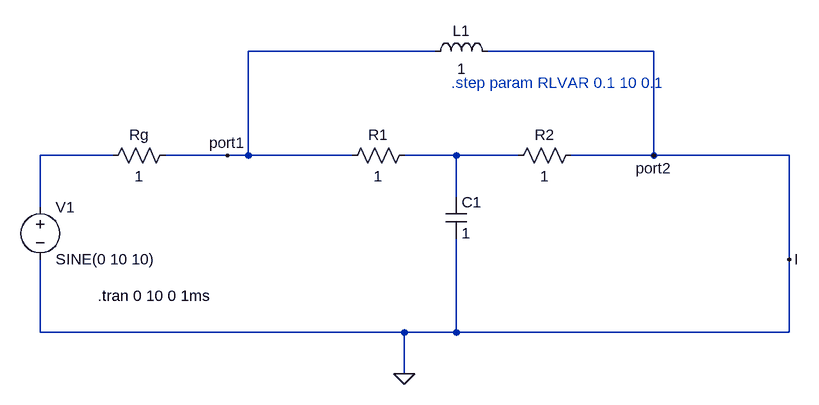
[diagram p0: schematic Draft3.asc]
Draft3.asc, the LTspice schematic file:
Version 4
SHEET 1 1396 680
WIRE 736 16 448 16
WIRE 1072 16 816 16
WIRE 240 176 128 176
WIRE 416 176 320 176
WIRE 448 176 448 16
WIRE 448 176 416 176
WIRE 608 176 448 176
WIRE 768 176 688 176
WIRE 864 176 768 176
WIRE 1072 176 1072 16
WIRE 1072 176 944 176
WIRE 1280 176 1072 176
WIRE 768 240 768 176
WIRE 128 256 128 176
WIRE 1280 336 1280 176
WIRE 128 448 128 336
WIRE 688 448 128 448
WIRE 768 448 768 304
WIRE 768 448 688 448
WIRE 1280 448 1280 336
WIRE 1280 448 768 448
WIRE 688 512 688 448
FLAG 688 512 0
FLAG 416 176 port1
FLAG 1072 176 port2
FLAG 1280 336 I
SYMBOL res 704 160 R90
WINDOW 0 0 56 VBottom 2
WINDOW 3 32 56 VTop 2
SYMATTR InstName R1
SYMATTR Value 1
SYMBOL res 960 160 R90
WINDOW 0 0 56 VBottom 2
WINDOW 3 32 56 VTop 2
SYMATTR InstName R2
SYMATTR Value 1
SYMBOL cap 752 240 R0
SYMATTR InstName C1
SYMATTR Value 1
SYMBOL ind 720 32 R270
WINDOW 0 32 56 VTop 2
WINDOW 3 5 56 VBottom 2
SYMATTR InstName L1
SYMATTR Value 1
SYMBOL res 336 160 R90
WINDOW 0 0 56 VBottom 2
WINDOW 3 32 56 VTop 2
SYMATTR InstName Rg
SYMATTR Value 1
SYMBOL voltage 128 240 R0
SYMATTR InstName V1
SYMATTR Value SINE(0 10 10)
TEXT 216 392 Left 2 !.tran 0 10 0 1ms
TEXT 760 64 Left 2 ;.step param RLVAR 0.1 10 0.1

The netlist it stands for:
* Draft3.asc
R1 N002 port1 1
R2 0 N002 1
C1 N002 0 1
L1 port1 0 1
Rg port1 N001 1
V1 N001 0 SINE(0 10 10)
.tran 0 10 0 1ms
* .step param RLVAR 0.1 10 0.1
.backanno
.end